# EasyEDA schematic Loop_Schematic_r1.1_easyeda.json
TITLE: Loop - Avionics Control-Board; REV: 1.1; Date: 2022-02-21; Sheet: 1/1; Drawn By: LL; Company: Lrocket
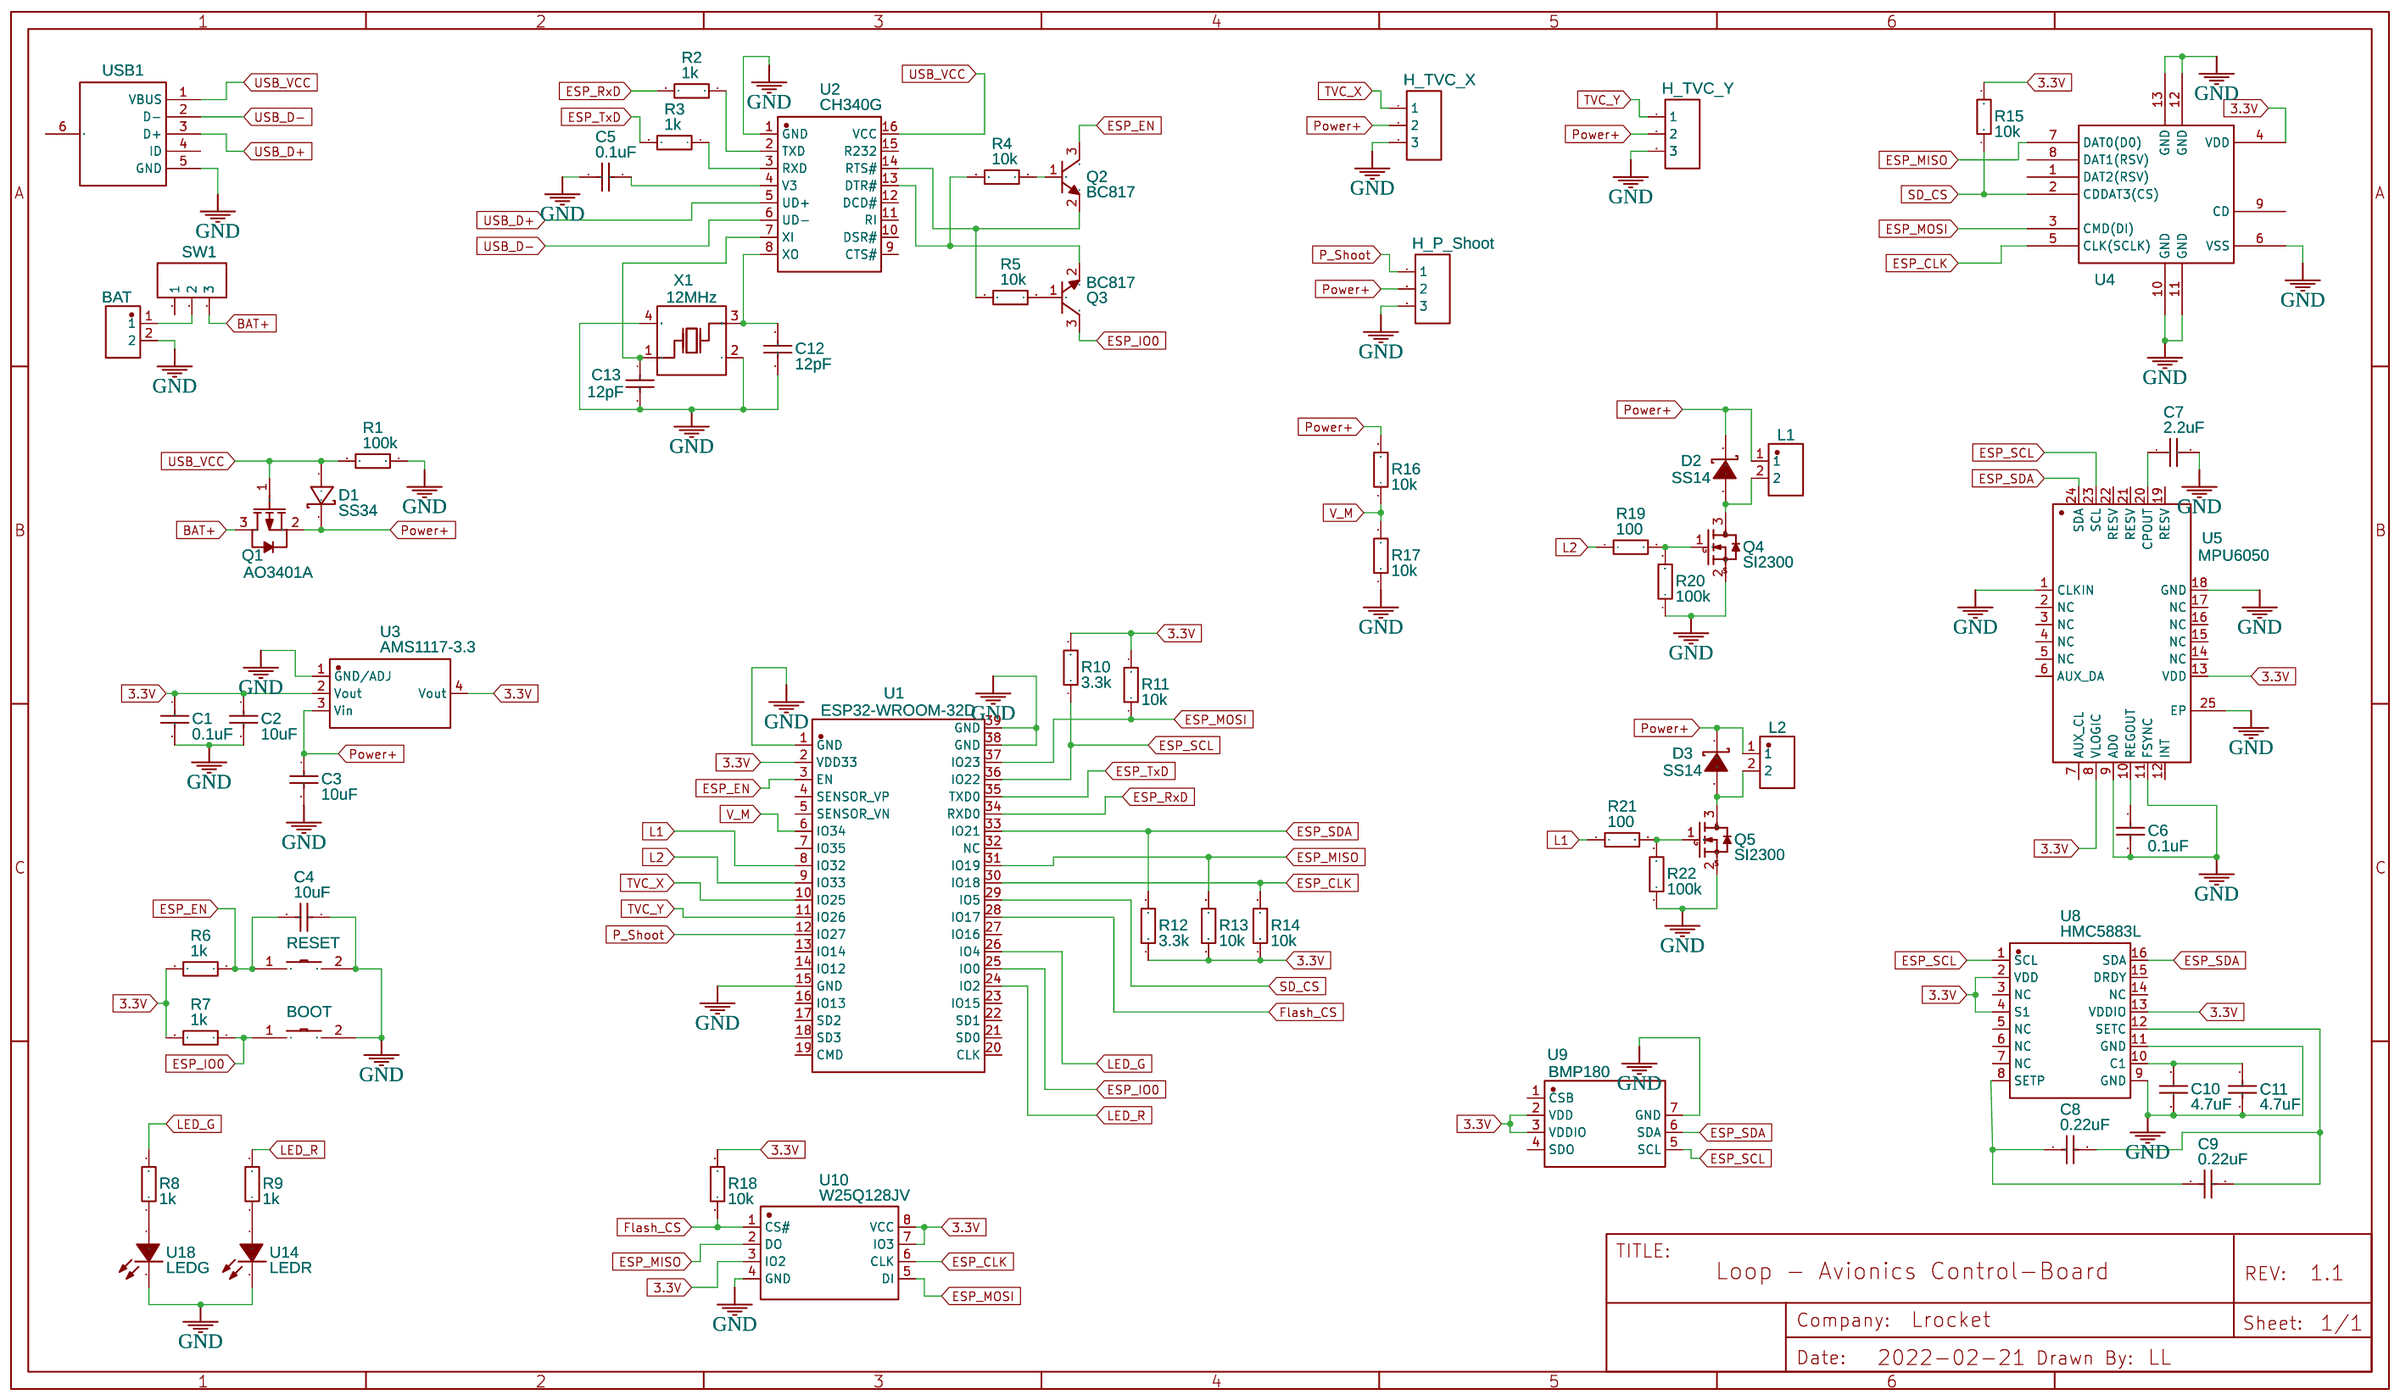
[diagram p0: schematic sheet]

## Parts
BAT  XY308-2.54-2P  [CONN-TH_XY308-2.54-2P]
BOOT  TS-1101-C-W  [SW-SMD_L6.0-W3.3-LS8.0]
C1  0.1uF  [C0603]
C2  10uF  [C0603]
C3  10uF  [C0603]
C4  10uF  [C0603]
C5  0.1uF  [C0603]
C6  0.1uF  [C0603]
C7  2.2uF  [C0603]
C8  0.22uF  [C0603]
C9  0.22uF  [C0805]
C10  4.7uF  [C0603]
C11  4.7uF  [C0805]
C12  12pF  [C0603]
C13  12pF  [C0603]
D1  SS34  [DO-214AC_L4.3-W2.7-LS5.3-RD]
D2  SS14  [SMA_L4.4-W2.8-LS5.4-RD]
D3  SS14  [SMA_L4.4-W2.8-LS5.4-RD]
L1  XY308-2.54-2P  [CONN-TH_XY308-2.54-2P]
L2  XY308-2.54-2P  [CONN-TH_XY308-2.54-2P]
P_SHOOT  H_P_Shoot  [HDR-TH_3P-P2.54-V-M-1]
Q1  AO3401A  [SOT-23_L2.9-W1.3-P1.90-LS2.4-BR]
Q2  BC817  [SOT-23-3_L2.9-W1.6-P1.90-LS2.8-BR]
Q3  BC817  [SOT-23-3_L2.9-W1.6-P1.90-LS2.8-BR]
Q4  SI2300  [SOT-23-3_L2.9-W1.3-P1.90-LS2.4-BR]
Q5  SI2300  [SOT-23-3_L2.9-W1.3-P1.90-LS2.4-BR]
R1  100k  [R0603]
R2  1k  [R0603]
R3  1k  [R0603]
R4  10k  [R0603]
R5  10k  [R0603]
R6  1k  [R0603]
R7  1k  [R0603]
R8  1k  [R0603]
R9  1k  [R0603]
R10  3.3k  [R0603]
R11  10k  [R0603]
R12  3.3k  [R0603]
R13  10k  [R0603]
R14  10k  [R0603]
R15  10k  [R0603]
R16  10k  [R0603]
R17  10k  [R0603]
R18  10k  [R0603]
R19  100  [R0603]
R20  100k  [R0603]
R21  100  [R0603]
R22  100k  [R0603]
RESET  TS-1101-C-W  [SW-SMD_L6.0-W3.3-LS8.0]
SW1  SW1  [HDR-TH_3P-P2.54-V-M-1]
TVC_X  H_TVC_X  [HDR-TH_3P-P2.54-V-M-1]
TVC_Y  H_TVC_Y  [HDR-TH_3P-P2.54-V-M-1]
U1  ESP32-WROOM-32D  [WIFIM-SMD_39P-L25.5-W18.0-P1.27-BL]
U2  CH340G  [SOIC-16_L9.9-W3.9-P1.27-LS6.0-BL]
U3  AMS1117-3.3  [SOT-223-3_L6.5-W3.4-P2.30-LS7.0-BR]
U4  TF-01A  [TF-SMD_TF-01A]
U5  MPU6050  [QFN-24_L4.0-W4.0-P0.50-BL-EP2.7]
U8  HMC5883L  [LPCC-16_L3.0-W3.0-P0.50-BL]
U9  BMP180  [LGA-7_L3.8-W3.6-P1.50-BL]
U10  W25Q128JV  [SOIC-8_L5.3-W5.3-P1.27-LS8.0-BL]
U14  LEDR  [LED0603-R-RD_WHITE]
U18  LEDG  [LED0603-R-RD_WHITE]
USB1  USB1  [MICRO-USB-SMD_U254-051T-4BH83-S1S]
X1  12MHz  [OSC-SMD_4P-L3.2-W2.5-BL]

## Library data of the parts
BAT L1 L2 = XY308-2.54-2P: Supplier: LCSC; Supplier Part: C557685; Manufacturer: --; Contributor: LCSC; JLCPCB Part Class: Extended Part
BOOT RESET = TS-1101-C-W: Supplier: LCSC; Supplier Part: C318938; Manufacturer: XKB Connectivity(中国星坤); Contributor: LCSC; JLCPCB Part Class: Extended Part
C1-C8 C10 C12 C13 = CC0603KRX7R9BB103: Supplier: LCSC; Manufacturer: YAGEO; Supplier Part: C100042; JLCPCB Part Class: Extended Part
C9 C11 = DLC1.5P-C0805: Supplier: LCSC; Supplier Part: C9900002366; JLCPCB Part Class: Extended Part; Contributor: LCSC
D1 = SS34_C8678: Supplier: LCSC; Manufacturer: MDD; Supplier Part: C8678; JLCPCB Part Class: Basic Part
D2 D3 = SS14: Supplier: LCSC; Manufacturer: MDD; Supplier Part: C2480; JLCPCB Part Class: Basic Part
P_SHOOT SW1 TVC_X TVC_Y = Header-Male-2.54_1x3: Supplier: LCSC; Manufacturer: BOOMELE; Manufacturer Part: Header2.54mm 1*3P; Supplier Part: C49257; JLCPCB Part Class: Extended Part
Q1 = AO3401A: Supplier: LCSC; Manufacturer: AOS; Supplier Part: C15127; JLCPCB Part Class: Basic Part
Q2 Q3 = BC817-25: Supplier: LCSC; Manufacturer: CJ; Supplier Part: C8588; JLCPCB Part Class: Extended Part
Q4 Q5 = SI2300: Supplier: LCSC; Manufacturer: Hottech; Contributor: LCSC; Supplier Part: C181085; JLCPCB Part Class: Extended Part
R1-R22 = TR0603B10KP05250.1W: Supplier: LCSC; Supplier Part: C188363; Manufacturer: Ever Ohms Tech; Contributor: LCSC
U1 = ESP32-WROOM-32D: Supplier: LCSC; Supplier Part: C473012; Manufacturer: ESPRESSIF 乐鑫; Contributor: LCSC; JLCPCB Part Class: Extended Part
U2 = CH340G: Supplier: LCSC; Manufacturer: WCH; Supplier Part: C14267; JLCPCB Part Class: Extended Part
U3 = AMS1117-3.3: sourceId: dwIGgezVh; Supplier: LCSC; Manufacturer: AMS; Supplier Part: C6186; JLCPCB Part Class: Basic Part
U4 = TF-01A: Supplier: LCSC; Manufacturer: HRO; Supplier Part: C91145; JLCPCB Part Class: Extended Part
U5 = MPU6050-YJLTY: Supplier: LCSC; Supplier Part: C2912107; Manufacturer: null; JLCPCB Part Class: Extended Part; Contributor: LCSC
U8 = HMC5883L: Supplier: LCSC; Supplier Part: C2859540; Manufacturer: null; JLCPCB Part Class: Extended Part; Contributor: LCSC
U9 = BMP180: Supplier: LCSC; Supplier Part: C438474; Manufacturer: Bosch Sensortec; Contributor: LCSC; JLCPCB Part Class: Extended Part
U10 = W25Q128JVSIQTR: Supplier: LCSC; Manufacturer: WINBOND; Supplier Part: C97521; JLCPCB Part Class: Basic Part
U14 U18 = SZYY0603W: Supplier: LCSC; Supplier Part: C434422; Manufacturer: Yongyu Photoelectric; Contributor: LCSC; JLCPCB Part Class: Extended Part
USB1 = U254-051T-4BH83-S1S: Supplier: LCSC; Supplier Part: C319160; Manufacturer: XKB Enterprise; Contributor: LCSC; JLCPCB Part Class: Extended Part
X1 = X322512MOB4SI: Supplier: LCSC; Manufacturer: YXC; Supplier Part: C70565; JLCPCB Part Class: Extended Part

## Nets
3.3V: C1.1 C2.1 R6.2 R7.2 R10.2 R11.2 R12.1 R13.1 R14.1 R15.2 R18.2 U1.2(VDD33) U3.2(Vout) U3.4(Vout) U4.4(VDD) U5.8(VLOGIC) U5.13(VDD) U8.2(VDD) U8.4(S1) U8.13(VDDIO) U9.2(VDD) U9.3(VDDIO) U10.3(IO2) U10.7(IO3) U10.8(VCC)
GND: BAT.2 BOOT.2 C1.2 C2.2 C3.2 C4.1 C5.2 C6.1 C7.2 C10.2 C11.2 C12.2 C13.2 P_SHOOT.3 Q4.2(S) Q5.2(S) R1.1 R17.1 R20.1 R22.1 RESET.2 TVC_X.3 TVC_Y.3 U1.1(GND) U1.15(GND) U1.38(GND) U1.39(GND) U2.1(GND) U3.1(GND/ADJ) U4.6(VSS) U4.10(GND) U4.11(GND) U4.12(GND) U4.13(GND) U5.1(CLKIN) U5.9(AD0) U5.11(FSYNC) U5.18(GND) U5.25(EP) U8.9(GND) U8.11(GND) U9.7(GND) U10.4(GND) U14.2(-) U18.2(-) USB1.5(GND) X1.2(GND) X1.4(GND)
BAT+: Q1.3(D) SW1.3
ESP_CLK: R14.2 U1.30(IO18) U4.5(CLK(SCLK)) U10.6(CLK)
ESP_EN: C4.2 Q2.3(C) R6.1 RESET.1 U1.3(EN)
ESP_IO0: BOOT.1 Q3.3(C) R7.1 U1.25(IO0)
ESP_MISO: R13.2 U1.31(IO19) U4.7(DAT0(D0)) U10.2(DO)
ESP_MOSI: R11.1 U1.37(IO23) U4.3(CMD(DI)) U10.5(DI)
ESP_RxD: R2.2 U1.34(RXD0)
ESP_SCL: R10.1 U1.36(IO22) U5.23(SCL) U8.1(SCL) U9.5(SCL)
ESP_SDA: R12.2 U1.33(IO21) U5.24(SDA) U8.16(SDA) U9.6(SDA)
ESP_TxD: R3.2 U1.35(TXD0)
Flash_CS: R18.1 U1.28(IO17) U10.1(CS#)
L1: R21.1 U1.8(IO32)
L2: R19.1 U1.9(IO33)
LED_G: R8.2 U1.26(IO4)
LED_R: R9.2 U1.24(IO2)
P_Shoot: P_SHOOT.1 U1.12(IO27)
Power+: C3.1 D1.1(K) D2.1(K) D3.1(K) L1.1 L2.1 P_SHOOT.2 Q1.2(S) R16.2 TVC_X.2 TVC_Y.2 U3.3(Vin)
SD_CS: R15.1 U1.29(IO5) U4.2(CDDAT3(CS))
TVC_X: TVC_X.1 U1.10(IO25)
TVC_Y: TVC_Y.1 U1.11(IO26)
USB_D+: U2.5(UD+) USB1.3(D+)
USB_D-: U2.6(UD-) USB1.2(D-)
USB_VCC: D1.2(A) Q1.1(G) R1.2 U2.16(VCC) USB1.1(VBUS)
V_M: R16.1 R17.2 U1.6(IO34)
Net-(BAT-1): BAT.1 SW1.2
Net-(C5-1): C5.1 U2.4(V3)
Net-(C6-2): C6.2 U5.10(REGOUT)
Net-(C7-1): C7.1 U5.20(CPOUT)
Net-(C8-1): C8.1 C9.1 U8.8(SETP)
Net-(C8-2): C8.2 C9.2 U8.12(SETC)
Net-(C10-1): C10.1 C11.1 U8.10(C1)
Net-(C12-1): C12.1 U2.8(XO) X1.3(OSC2)
Net-(C13-1): C13.1 U2.7(XI) X1.1(OSC1)
Net-(D2-2): D2.2(A) L1.2 Q4.3(D)
Net-(D3-2): D3.2(A) L2.2 Q5.3(D)
Net-(Q2-1): Q2.1(B) R4.1
Net-(Q2-2): Q2.2(E) R5.2 U2.14(RTS#)
Net-(Q3-1): Q3.1(B) R5.1
Net-(Q3-2): Q3.2(E) R4.2 U2.13(DTR#)
Net-(Q4-1): Q4.1(G) R19.2 R20.2
Net-(Q5-1): Q5.1(G) R21.2 R22.2
Net-(R2-1): R2.1 U2.2(TXD)
Net-(R3-1): R3.1 U2.3(RXD)
Net-(R8-1): R8.1 U18.1(+)
Net-(R9-1): R9.1 U14.1(+)

Not connected (* = marked no-connect by the designer): SW1 1; U1 4(SENSOR_VP) 5(SENSOR_VN) 7(IO35) 13(IO14) 14(IO12) 16(IO13) 17(SD2) 18(SD3) 19(CMD) 20(CLK) 21(SD0) 22(SD1) 23(IO15) 27(IO16) 32(NC); U2 9(CTS#) 10(DSR#) 11(RI) 12(DCD#) 15(R232); U4 1(DAT2(RSV)) 8(DAT1(RSV)) 9(CD); U5 2(NC) 3(NC) 4(NC) 5(NC) 6(AUX_DA) 7(AUX_CL) 12(INT) 14(NC) 15(NC) 16(NC) 17(NC) 19(RESV) 21(RESV) 22(RESV); U8 3(NC) 5(NC) 6(NC) 7(NC) 14(NC) 15(DRDY); U9 1(CSB) 4(SDO); USB1 4(ID) 6(EH)
